# EAGLE design EGB220_Team2 (EAGLE 7.5.0)
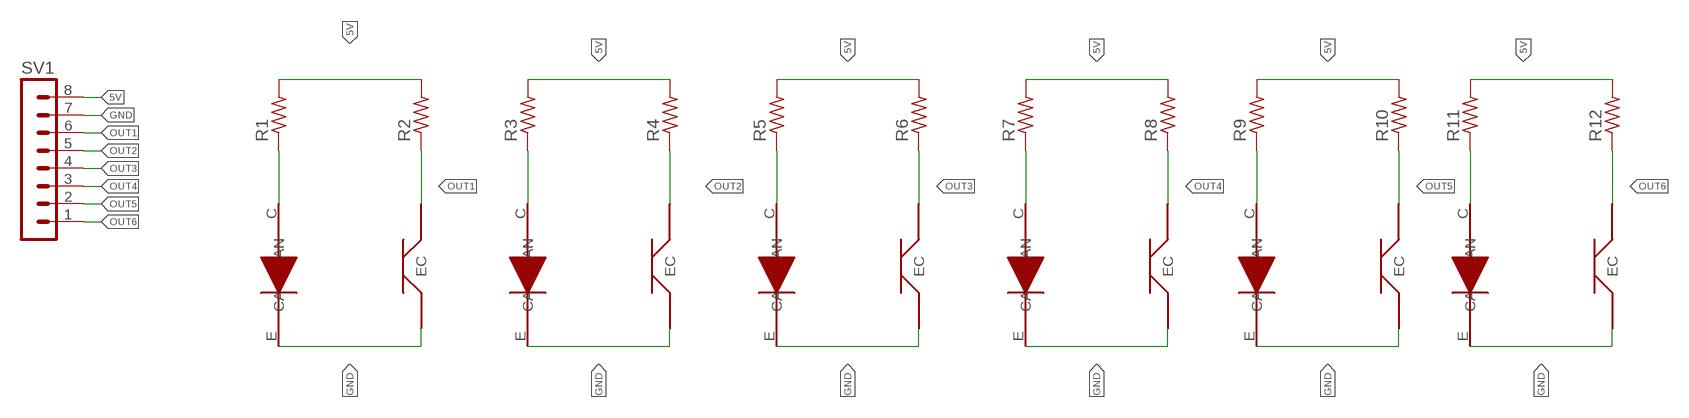
[diagram p0: schematic, sheet 1]

## Parts
LED-R1  LED  [PHOTO-DIODE]
LED-R3  LED  [PHOTO-DIODE]
LED-R5  LED  [PHOTO-DIODE]
LED-R7  LED  [PHOTO-DIODE]
LED-R9  LED  [PHOTO-DIODE]
LED-R11  LED  [PHOTO-DIODE]
R1  R-US_0204/7  [0204/7]
R2  R-US_0204/7  [0204/7]
R3  R-US_0204/7  [0204/7]
R4  R-US_0204/7  [0204/7]
R5  R-US_0204/7  [0204/7]
R6  R-US_0204/7  [0204/7]
R7  R-US_0204/7  [0204/7]
R8  R-US_0204/7  [0204/7]
R9  R-US_0204/7  [0204/7]
R10  R-US_0204/7  [0204/7]
R11  R-US_0204/7  [0204/7]
R12  R-US_0204/7  [0204/7]
SV1  MA08-1  [MA08-1]
T-R2  PHOTO_DIODE  [PHOTO-DIODE]
T-R4  PHOTO_DIODE  [PHOTO-DIODE]
T-R6  PHOTO_DIODE  [PHOTO-DIODE]
T-R8  PHOTO_DIODE  [PHOTO-DIODE]
T-R10  PHOTO_DIODE  [PHOTO-DIODE]
T-R12  PHOTO_DIODE  [PHOTO-DIODE]

## Nets
5V: R1.2 R2.2 R3.2 R4.2 R5.2 R6.2 R7.2 R8.2 R9.2 R10.2 R11.2 R12.2 SV1.8
GND: LED-R1.E(CA) LED-R3.E(CA) LED-R5.E(CA) LED-R7.E(CA) LED-R9.E(CA) LED-R11.E(CA) SV1.7 T-R2.E T-R4.E T-R6.E T-R8.E T-R10.E T-R12.E
N$3: LED-R1.C(AN) R1.1
N$7: LED-R3.C(AN) R3.1
N$11: LED-R5.C(AN) R5.1
N$15: LED-R7.C(AN) R7.1
N$19: LED-R9.C(AN) R9.1
N$23: LED-R11.C(AN) R11.1
OUT1: R2.1 SV1.6 T-R2.C
OUT2: R4.1 SV1.5 T-R4.C
OUT3: R6.1 SV1.4 T-R6.C
OUT4: R8.1 SV1.3 T-R8.C
OUT5: R10.1 SV1.2 T-R10.C
OUT6: R12.1 SV1.1 T-R12.C

## Library data of the parts
LED-R1 LED-R3 LED-R5 LED-R7 LED-R9 LED-R11 = EGB220_Team2:LED
R1-R12 = rcl:R-US_: RESISTOR, American symbol
SV1 = con-lstb:MA08-1: PIN HEADER; OC_FARNELL: unknown; OC_NEWARK: unknown
T-R2 T-R4 T-R6 T-R8 T-R10 T-R12 = EGB220_Team2:PHOTO_DIODE

## Board
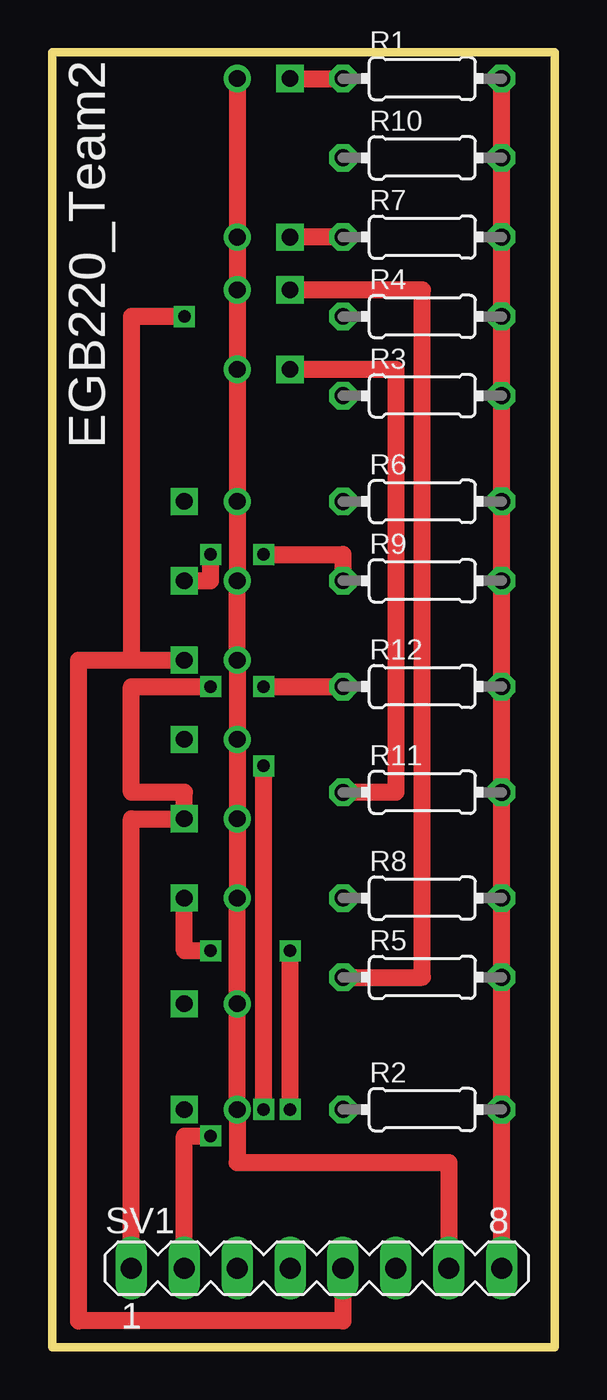
[diagram p1: board, top side]
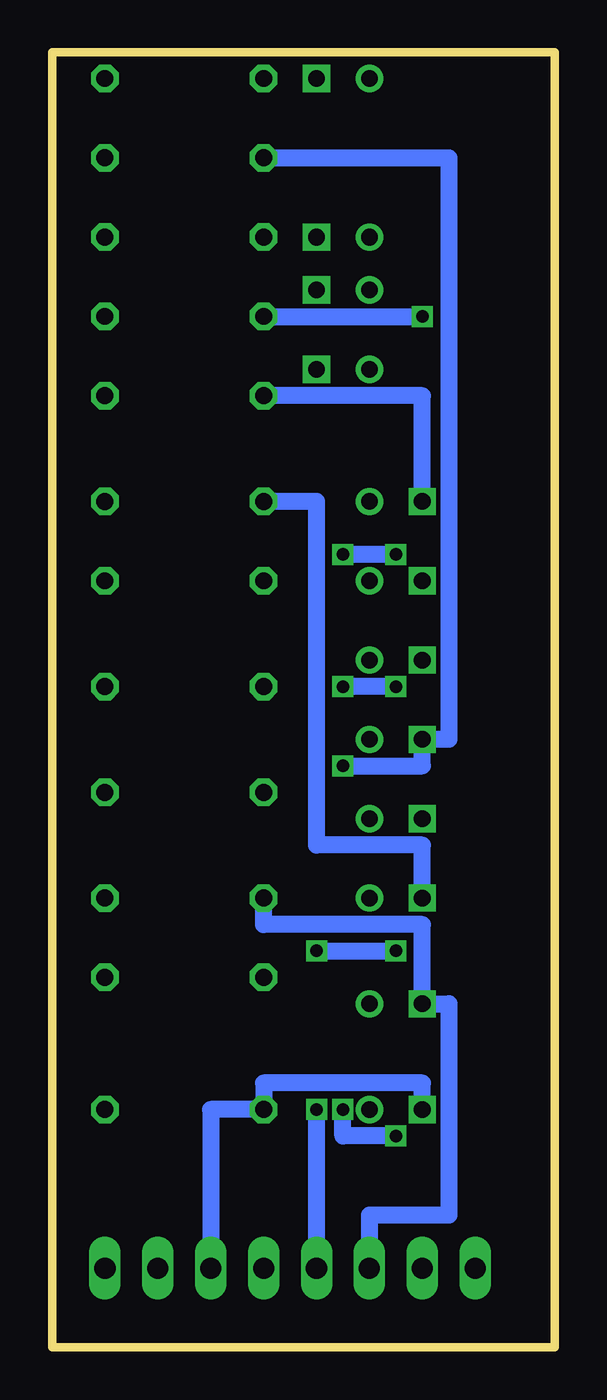
[diagram p2: board, bottom side, seen from below]

Size 24.13 x 62.23 mm. Coordinates in mm from the lower left corner, seen from the top.
Outline: 0,62.23 0,0 24.13,0 24.13,62.23 0,62.23
Copper layers (1*16): Top 0.035mm / dielectric 1.5mm / Bottom 0.035mm
Design rules "default": minimum track width 10mil, minimum drill 24mil, track to track 8mil, track to pad 8mil, pad to pad 8mil, via to via 8mil, smd to smd 8mil, copper to edge 40mil, drill to drill 8mil, minimum pad ring 10mil, minimum via ring 8mil, stop-mask expansion 4mil, vias tented up to drill 0mil, thermal gap 10mil

### Footprints (pad centres in the part's own frame; a part is rotated, then mirrored left to right if it is on the bottom)
PHOTO-DIODE = drill 0.8 square: C -1.27,0 | drill 0.8: E 1.27,0
0204/7 = drill 0.813 octagon: 1 -3.81,0; 2 3.81,0
MA08-1 = drill 1.016 long: 1 -8.89,0; 2 -6.35,0; 3 -3.81,0; 4 -1.27,0; 5 1.27,0; 6 3.81,0; 7 6.35,0; 8 8.89,0

### Placement (x,y rotation side)
LED-R1  10.16,60.96 180 top
LED-R3  7.62,40.64 0 top
LED-R5  10.16,50.8 180 top
LED-R7  10.16,53.34 180 top
LED-R9  7.62,36.83 0 top
LED-R11  10.16,46.99 180 top
R1  17.78,60.96 0 top
R2  17.78,11.43 0 top
R3  17.78,45.72 0 top
R4  17.78,49.53 0 top
R5  17.78,17.78 0 top
R6  17.78,40.64 0 top
R7  17.78,53.34 0 top
R8  17.78,21.59 0 top
R9  17.78,36.83 0 top
R10  17.78,57.15 0 top
R11  17.78,26.67 0 top
R12  17.78,31.75 0 top
SV1  12.7,3.81 0 top
T-R2  7.62,11.43 0 top
T-R4  7.62,33.02 0 top
T-R6  7.62,21.59 0 top
T-R8  7.62,16.51 0 top
T-R10  7.62,29.21 0 top
T-R12  7.62,25.4 0 top

### Tracks (layer width: path | path; a pad name or v marks a point on that pad's centre or on a via)
5V
  Top 0.813: SV1.8 R2.2 R5.2 R8.2 R11.2 R12.2 R9.2 R6.2 R3.2 R4.2 | R4.2 R7.2 | R4.2 R10.2 R1.2
GND
  Top 0.813: LED-R1.E LED-R7.E LED-R5.E LED-R11.E LED-R3.E LED-R9.E T-R4.E T-R10.E T-R12.E T-R6.E T-R8.E T-R2.E 8.89,8.89 19.05,8.89 SV1.7
N$3
  Top 0.813: LED-R1.C R1.1
N$7
  Bottom 0.813: LED-R3.C 6.35,45.72 R3.1
N$11
  Top 0.813: R5.1 17.78,17.78 17.78,50.8 LED-R5.C
N$15
  Top 0.813: R7.1 LED-R7.C
N$19  (via drill 0.6)
  Top 0.813: LED-R9.C 7.62,36.83 v7.62,38.1 | v10.16,38.1 13.97,38.1 R9.1
  Bottom 0.813: v7.62,38.1 v10.16,38.1
N$23
  Top 0.813: LED-R11.C 16.51,46.99 16.51,26.67 R11.1
OUT1
  Bottom 0.813: SV1.6 16.51,11.43 R2.1 13.97,12.7 6.35,12.7 T-R2.C
OUT2  (via drill 0.6)
  Top 0.813: SV1.5 13.97,1.27 1.27,1.27 1.27,33.02 3.81,33.02 | 3.81,33.02 T-R4.C | v6.35,49.53 3.81,49.53 3.81,33.02
  Bottom 0.813: R4.1 v6.35,49.53
OUT3  (via drill 0.6)
  Top 0.813: v11.43,11.43 v11.43,19.05 | v7.62,19.05 6.35,19.05 T-R6.C
  Bottom 0.813: SV1.4 v11.43,11.43 | v11.43,19.05 v7.62,19.05 | T-R6.C 6.35,24.13 11.43,24.13 11.43,40.64 R6.1
OUT4
  Bottom 0.813: SV1.3 8.89,6.35 5.08,6.35 5.08,16.51 T-R8.C 6.35,20.32 13.97,20.32 R8.1
OUT5  (via drill 0.6)
  Top 0.813: SV1.2 6.35,10.16 v7.62,10.16 | v10.16,11.43 v10.16,27.94
  Bottom 0.813: R10.1 5.08,57.15 5.08,29.21 T-R10.C 6.35,27.94 v10.16,27.94 | v7.62,10.16 10.16,10.16 v10.16,11.43
OUT6  (via drill 0.6)
  Top 0.813: SV1.1 3.81,25.4 T-R12.C 6.35,26.67 3.81,26.67 3.81,31.75 v7.62,31.75 | v10.16,31.75 R12.1
  Bottom 0.813: v7.62,31.75 v10.16,31.75

### Text on the board
tPlace: EGB220_Team2